# Altium schematic sheet LVDCLINK22v1.SchDoc
size A4; SheetNumber: 1; SheetTotal: 1
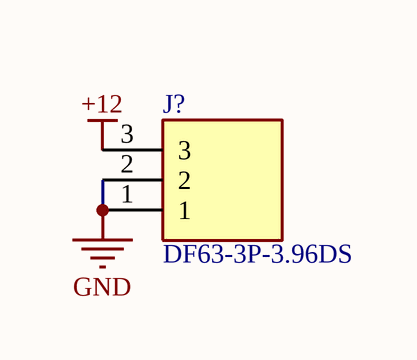
[diagram p0: LVDCLINK22v1.SchDoc]

## Parts
J?  DF63-3P-3.96DS  [DF633P396DS]

## Nets
+12: J?.3
GND: J?.1 J?.2

## Library data of the parts
J? = DF63-3P-3.96DS: Connector; Manufacturer_Name: Hirose; Datasheet Link: https://www.mouser.co.uk/datasheet/2/185/DF63_catalog-1066197.pdf; Height: 10mm; Manufacturer_Part_Number: DF63-3P-3.96DS; Mouser Part Number: 798-DF63-3P-3.96DS; Mouser Price/Stock: https://www.mouser.co.uk/ProductDetail/Hirose-Connector/DF63-3P-396DS?qs=vcbW%252B4%252BSTIosvrYGqXVyWg%3D%3D